# Altium schematic sheet MCU.SchDoc: Firefly Mini MCU
size Legal; DrawnBy: Jakub Czarny; SheetNumber: 2; SheetTotal: 7
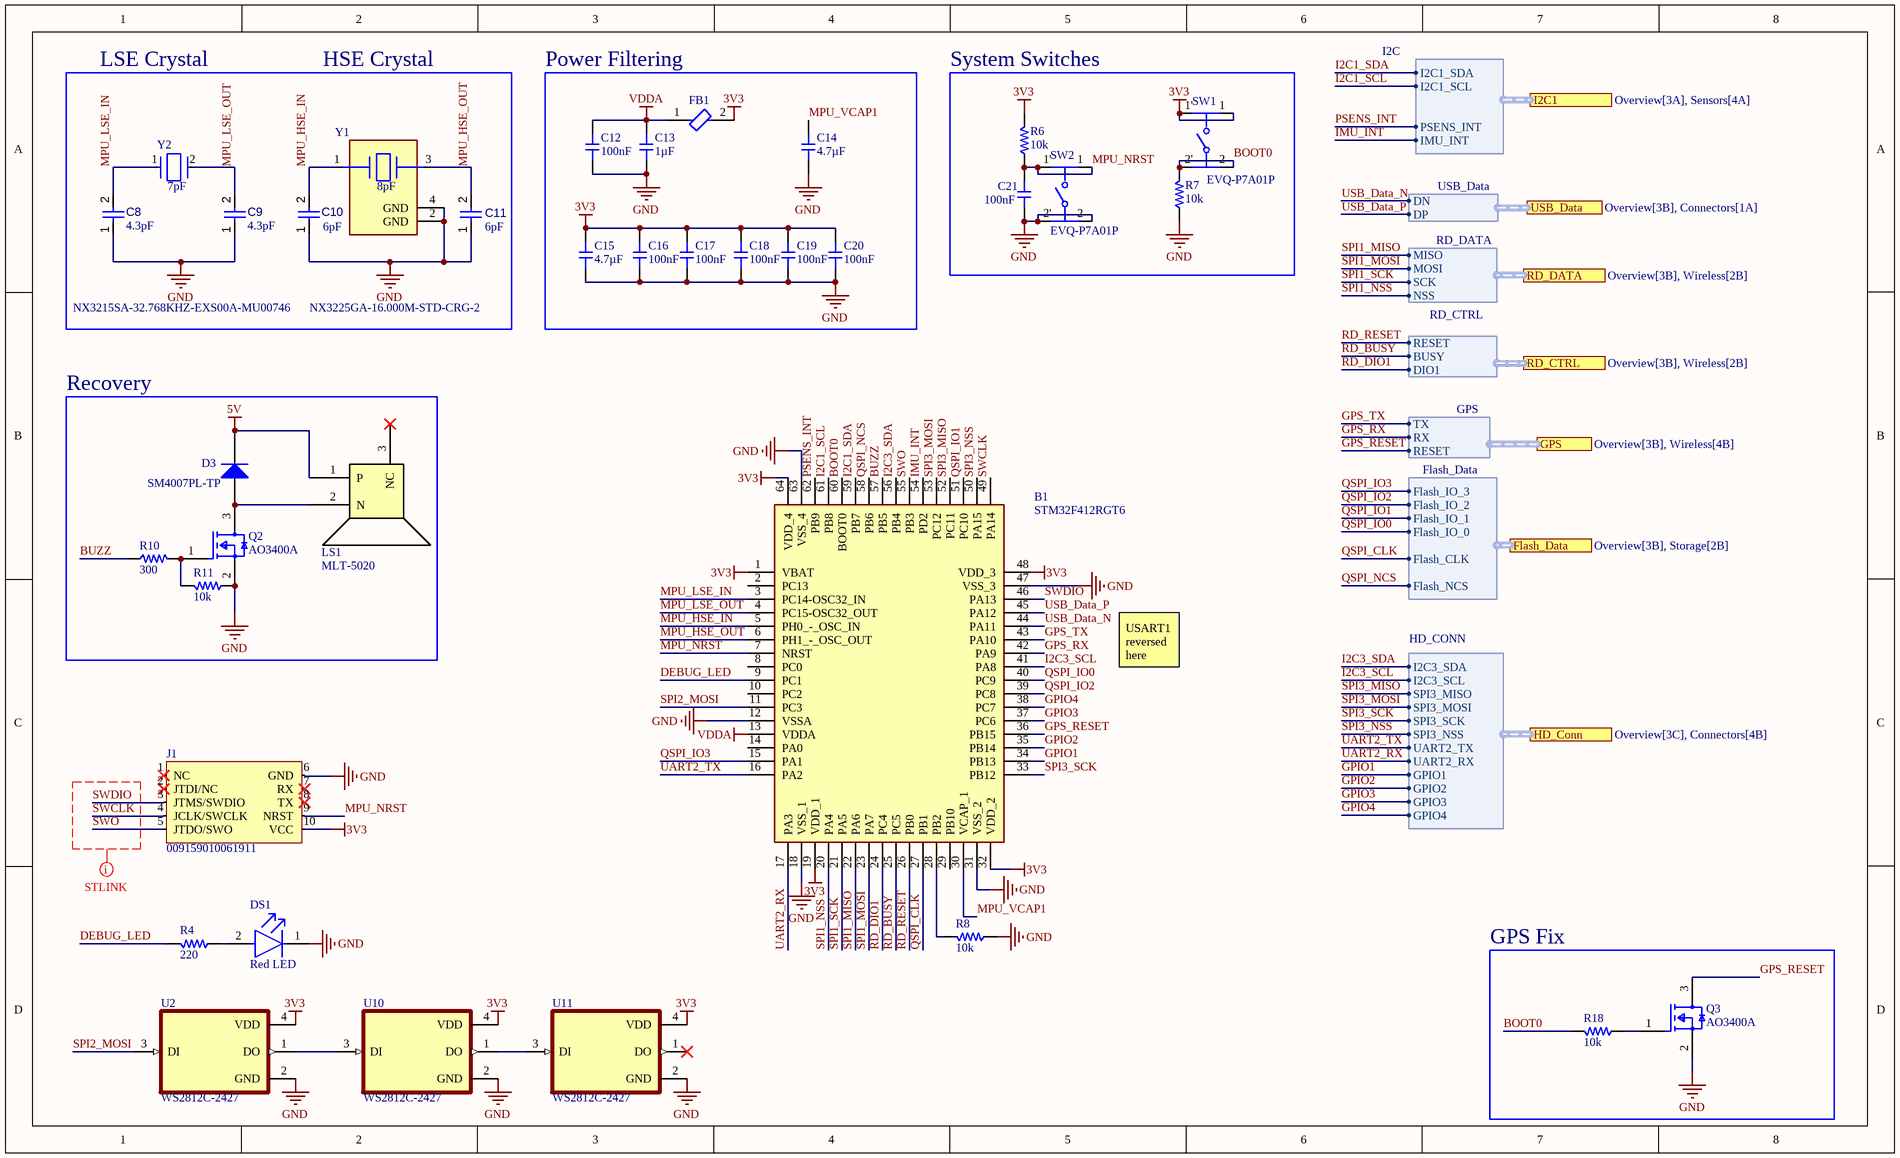
[diagram p0: MCU.SchDoc]

## Parts
B1  STM32F412RGT6  [QFP50P1200X1200X160-64N]
C8  value 4.3pF  [CAP-0402]  (hidden comment: C1005NP0439CGTS)
C9  value 4.3pF  [CAP-0402]  (hidden comment: C1005NP0439CGTS)
C10  value 6pF  [CAP-0402]  (hidden comment: 0402CG6R0C500NT)
C11  value 6pF  [CAP-0402]  (hidden comment: 0402CG6R0C500NT)
C12  value 100nF  [CAP-0402]  (hidden comment: CL05B104KO5NNNC)
C13  value 1µF  [CAP-0402]  (hidden comment: CL05A105KA5NQNC)
C14  value 4.7µF  [CAP-0402]  (hidden comment: CL05A475MP5NRNC)
C15  value 4.7µF  [CAP-0402]  (hidden comment: CL05A475MP5NRNC)
C16  value 100nF  [CAP-0402]  (hidden comment: CL05B104KO5NNNC)
C17  value 100nF  [CAP-0402]  (hidden comment: CL05B104KO5NNNC)
C18  value 100nF  [CAP-0402]  (hidden comment: CL05B104KO5NNNC)
C19  value 100nF  [CAP-0402]  (hidden comment: CL05B104KO5NNNC)
C20  value 100nF  [CAP-0402]  (hidden comment: CL05B104KO5NNNC)
C21  value 100nF  [CAP-0402]  (hidden comment: CL05B104KO5NNNC)
D3  SM4007PL-TP  [MCC-SOD-123FL_V]
DS1  Red LED  [FP-LTST-C190GKT-MFG]
FB1  BLM15AG601SN1D  [FP-BLM15-0_05-IPC_A]  (value not drawn)
J1  009159010061911  [009159010061911-Footprint-1]
LS1  MLT-5020  [MLT-5020]
Q2  AO3400A  [FP-SOT23-IPC_C]
Q3  AO3400A  [FP-SOT23-IPC_C]
R4  value 220  [RES-0402]  (hidden comment: 0402WGF2200TCE)
R6  value 10k  [RES-0402]  (hidden comment: 0402WGF1002TCE)
R7  value 10k  [RES-0402]  (hidden comment: 0402WGF1002TCE)
R8  value 10k  [RES-0402]  (hidden comment: 0402WGF1002TCE)
R10  value 300  [RES-0402]  (hidden comment: 0402WGF3000TCE)
R11  value 10k  [RES-0402]  (hidden comment: 0402WGF1002TCE)
R18  value 10k  [RES-0402]  (hidden comment: 0402WGF1002TCE)
SW1  EVQ-P7A01P  [FP-EVQ-P7A01P-MFG]
SW2  EVQ-P7A01P  [FP-EVQ-P7A01P-MFG]
U2  WS2812C-2427  [WS2812C-2427-Footprint-1]
U10  WS2812C-2427  [WS2812C-2427-Footprint-1]
U11  WS2812C-2427  [WS2812C-2427-Footprint-1]
Y1  NX3225GA-16.000M-STD-CRG-2  value 8pF  [FP-NX3225GA-MFG]
Y2  NX3215SA-32.768KHZ-EXS00A-MU00746  value 7pF  [FP-NX3215SA-MFG]

## Blocks framed on the sheet
Power Filtering: C12-C20 FB1
System Switches: C21 R6 R7 SW1 SW2
Recovery: D3 LS1 Q2 R10 R11
GPS Fix: Q3 R18

## Ports
Flash_Data (harness Flash_Data, see Overview[3B], Storage[2B]), GPS (harness GPS, see Overview[3B], Wireless[4B]), HD_Conn (harness HD_CONN, see Overview[3C], Connectors[4B]), I2C1 (harness I2C, see Overview[3A], Sensors[4A]), RD_CTRL (harness RD_CTRL, see Overview[3B], Wireless[2B]), RD_DATA (harness RD_DATA, see Overview[3B], Wireless[2B]), USB_Data (harness USB_Data, see Overview[3B], Connectors[1A])

## Harnesses
USB_Data: DP, DN
RD_DATA: MISO, MOSI, SCK, NSS
RD_CTRL: RESET, BUSY, DIO1
GPS: TX, RX, RESET
Flash_Data: Flash_NCS, Flash_CLK, Flash_IO_0, Flash_IO_1, Flash_IO_2, Flash_IO_3
I2C: I2C1_SDA, I2C1_SCL, PSENS_INT, IMU_INT
HD_CONN: I2C3_SDA, I2C3_SCL, SPI3_MISO, SPI3_MOSI, SPI3_SCK, SPI3_NSS, UART2_TX, UART2_RX, GPIO1, GPIO2, GPIO3, GPIO4

## Nets
3V3: B1.1(VBAT) B1.19(VDD_1) B1.32(VDD_2) B1.48(VDD_3) B1.64(VDD_4) C15.2 C16.2 C17.2 C18.2 C19.2 C20.2 FB1.2 J1.10(VCC) R6.2 SW1.1 SW1.1' U2.4(VDD) U10.4(VDD) U11.4(VDD)
5V: D3.2(K) LS1.1(P)
GND: B1.12(VSSA) B1.18(VSS_1) B1.31(VSS_2) B1.47(VSS_3) B1.63(VSS_4) C8.1 C9.1 C10.1 C11.1 C12.1 C13.1 C14.1 C15.1 C16.1 C17.1 C18.1 C19.1 C20.1 C21.1 DS1.1(C) J1.6(GND) Q2.2(S) Q3.2(S) R7.1 R8.1 R11.1 SW2.2 SW2.2' U2.2(GND) U10.2(GND) U11.2(GND) Y1.2(GND) Y1.4(GND)
VDDA: B1.13(VDDA) C12.2 C13.2 FB1.1
BOOT0: B1.60(BOOT0) R7.2 R18.2 SW1.2 SW1.2'
BUZZ: B1.57(PB5) R10.1
DEBUG_LED: B1.9(PC1) R4.2
GPIO1: B1.34(PB13) ; port HD_Conn.GPIO1
GPIO2: B1.35(PB14) ; port HD_Conn.GPIO2
GPIO3: B1.37(PC6) ; port HD_Conn.GPIO3
GPIO4: B1.38(PC7) ; port HD_Conn.GPIO4
GPS_RESET: B1.36(PB15) Q3.3(D) ; port GPS.RESET
GPS_RX: B1.42(PA9) ; port GPS.RX
GPS_TX: B1.43(PA10) ; port GPS.TX
I2C1_SCL: B1.61(PB8) ; port I2C1.I2C1_SCL
I2C1_SDA: B1.59(PB7) ; port I2C1.I2C1_SDA
I2C3_SCL: B1.41(PA8) ; port HD_Conn.I2C3_SCL
I2C3_SDA: B1.56(PB4) ; port HD_Conn.I2C3_SDA
IMU_INT: B1.54(PD2) ; port I2C1.IMU_INT
MPU_HSE_IN: B1.5(PH0_-_OSC_IN) C10.2 Y1.1
MPU_HSE_OUT: B1.6(PH1_-_OSC_OUT) C11.2 Y1.3
MPU_LSE_IN: B1.3(PC14-OSC32_IN) C8.2 Y2.1
MPU_LSE_OUT: B1.4(PC15-OSC32_OUT) C9.2 Y2.2
MPU_NRST: B1.7(NRST) C21.2 J1.9(NRST) R6.1 SW2.1 SW2.1'
MPU_VCAP1: B1.30(VCAP_1) C14.2
PSENS_INT: B1.62(PB9) ; port I2C1.PSENS_INT
QSPI_CLK: B1.27(PB1) ; port Flash_Data.Flash_CLK
QSPI_IO0: B1.40(PC9) ; port Flash_Data.Flash_IO_0
QSPI_IO1: B1.51(PC10) ; port Flash_Data.Flash_IO_1
QSPI_IO2: B1.39(PC8) ; port Flash_Data.Flash_IO_2
QSPI_IO3: B1.15(PA1) ; port Flash_Data.Flash_IO_3
QSPI_NCS: B1.58(PB6) ; port Flash_Data.Flash_NCS
RD_BUSY: B1.25(PC5) ; port RD_CTRL.BUSY
RD_DIO1: B1.24(PC4) ; port RD_CTRL.DIO1
RD_RESET: B1.26(PB0) ; port RD_CTRL.RESET
SPI1_MISO: B1.22(PA6) ; port RD_DATA.MISO
SPI1_MOSI: B1.23(PA7) ; port RD_DATA.MOSI
SPI1_NSS: B1.20(PA4) ; port RD_DATA.NSS
SPI1_SCK: B1.21(PA5) ; port RD_DATA.SCK
SPI2_MOSI: B1.11(PC3) U2.3(DI)
SPI3_MISO: B1.52(PC11) ; port HD_Conn.SPI3_MISO
SPI3_MOSI: B1.53(PC12) ; port HD_Conn.SPI3_MOSI
SPI3_NSS: B1.50(PA15) ; port HD_Conn.SPI3_NSS
SPI3_SCK: B1.33(PB12) ; port HD_Conn.SPI3_SCK
SWCLK: B1.49(PA14) J1.4(JCLK/SWCLK)
SWDIO: B1.46(PA13) J1.3(JTMS/SWDIO)
SWO: B1.55(PB3) J1.5(JTDO/SWO)
UART2_RX: B1.17(PA3) ; port HD_Conn.UART2_RX
UART2_TX: B1.16(PA2) ; port HD_Conn.UART2_TX
USB_Data_N: B1.44(PA11) ; port USB_Data.DN
USB_Data_P: B1.45(PA12) ; port USB_Data.DP
NetB1_28: B1.28(PB2) R8.2
NetD3_1: D3.1(A) LS1.2(N) Q2.3(D)
NetDS1_2: DS1.2(A) R4.1
NetQ2_1: Q2.1(G) R10.2 R11.2
NetQ3_1: Q3.1(G) R18.1
NetU2_1: U2.1(DO) U10.3(DI)
NetU10_1: U10.1(DO) U11.3(DI)

Not connected (* = marked no-connect by the designer): B1 2(PC13) 8(PC0) 10(PC2) 14(PA0) 29(PB10); J1 1(NC)* 2(JTDI/NC)* 7(RX)* 8(TX)*; LS1 3(NC)*; U11 1(DO)*

## Layout directives
rule Matched Net Lengths [Tolerance = 0.1mm]; net class STLINK: SWCLK, SWDIO, SWO

## Notes on the sheet
- LSE Crystal
- HSE Crystal
- USART1 reversed here

## Library data of the parts
B1 = CMP-020-00025-2: ARM Microcontrollers - MCU 16/32-BITS MICROS; Manufacturer: STMicroelectronics; Geometry.Height: 1.6mm; Arrow Price/Stock: https://www.arrow.com/en/products/stm32f412rgt6/stmicroelectronics?region=nac; Design Item ID: STM32F412RGT6; Manufacturer_Part_Number: STM32F412RGT6; Mouser Price/Stock: https://www.mouser.co.uk/ProductDetail/STMicroelectronics/STM32F412RGT6?qs=qzCNEk%252BRr%252Bb0WoPVhlRQfQ%3D%3D; Mouser Part Number: 511-STM32F412RGT6; Source: STM32F412RGT6.SchLib; Arrow Part Number: STM32F412RGT6; Datasheet Link: http://www.st.com/content/ccc/resource/technical/document/datasheet/15/90/07/b3/8c/10/4e/95/DM00213872.pdf/files/DM00213872.pdf/jcr:content/translations/en.DM00213872.pdf; JLCPCB Part Number: C94351
C8 C9 = CMP-001-02165-2: 50V 4.3pF NP0 0402  Multilayer Ceramic Capacitors MLCC - SMD/SMT ROHS; JLCPCB Part Number: C147367
C10 C11 = CMP-001-02164-2: 50V 6pF C0G 0402  Multilayer Ceramic Capacitors MLCC - SMD/SMT ROHS; JLCPCB Part Number: C1575
C12 C16-C21 = CMP-001-00142-1: Capacitor, Ceramic (MLCC), 100nF, ±10%, 16V, X7R, ±10%, SMD 0402; Manufacturer: Samsung Electro-Mechanics; Design Item ID: CL05B104KO5NNNC; Source: jlcpcb_capacitors_basic.schlib; ComponentLink2URL: https://jlcpcb.com/partdetail/C1525; Voltage Rating: 16V; Tolerance: 10%; Temperature Coefficient: X7R; ComponentLink2Description: JLCPCB Part URL; ComponentLink1URL: https://datasheet.lcsc.com/lcsc/1810191219_Samsung-Electro-Mechanics-CL05B104KO5NNNC_C1525.pdf; JLCPCB Basic Part: Yes; JLCPCB Part Number: C1525; ComponentLink3URL: https://lcsc.com/product-detail/Multilayer-Ceramic-Capacitors-MLCC---SMD-SMT_Samsung-Electro-Mechanics-Samsung-Electro-Mechanics-CL05B104KO5NNNC_C1525.html; Manufacturer Part Number: CL05B104KO5NNNC; ComponentLink1Description: Datasheet; Case/Package: 0402; RoHS: Yes; Category: Capacitors - MLCC; ComponentLink3Description: LCSC Part URL
C13 = CMP-001-00135-1: Capacitor, Ceramic (MLCC), 1uF, ±10%, 25V, X5R, ±10%, SMD 0402; Manufacturer: Samsung Electro-Mechanics; Voltage Rating: 25V; RoHS: Yes; Temperature Coefficient: X5R; Tolerance: 10%; Source: jlcpcb_capacitors_basic.schlib; ComponentLink1URL: https://datasheet.lcsc.com/lcsc/1811091611_Samsung-Electro-Mechanics-CL05A105KA5NQNC_C52923.pdf; JLCPCB Basic Part: Yes; ComponentLink1Description: Datasheet; ComponentLink2URL: https://jlcpcb.com/partdetail/C52923; Case/Package: 0402; ComponentLink3Description: LCSC Part URL; Manufacturer Part Number: CL05A105KA5NQNC; ComponentLink3URL: https://lcsc.com/product-detail/Multilayer-Ceramic-Capacitors-MLCC---SMD-SMT_Samsung-Electro-Mechanics-Samsung-Electro-Mechanics-CL05A105KA5NQNC_C52923.html; Design Item ID: CL05A105KA5NQNC; JLCPCB Part Number: C52923; ComponentLink2Description: JLCPCB Part URL; Category: Capacitors - MLCC
C14 C15 = CMP-001-00139-1: Capacitor, Ceramic (MLCC), 4.7uF, ±20%, 10V, X5R, ±20%, SMD 0402; Manufacturer: Samsung Electro-Mechanics; RoHS: Yes; Tolerance: 20%; Manufacturer Part Number: CL05A475MP5NRNC; ComponentLink3Description: LCSC Part URL; Source: jlcpcb_capacitors_basic.schlib; JLCPCB Part Number: C23733; ComponentLink2Description: JLCPCB Part URL; Temperature Coefficient: X5R; Voltage Rating: 10V; JLCPCB Basic Part: Yes; Case/Package: 0402; Category: Capacitors - MLCC; ComponentLink1URL: https://datasheet.lcsc.com/lcsc/1810191211_Samsung-Electro-Mechanics-CL05A475MP5NRNC_C23733.pdf; ComponentLink2URL: https://jlcpcb.com/partdetail/C23733; ComponentLink1Description: Datasheet; ComponentLink3URL: https://lcsc.com/product-detail/Multilayer-Ceramic-Capacitors-MLCC---SMD-SMT_Samsung-Electro-Mechanics-Samsung-Electro-Mechanics-CL05A475MP5NRNC_C23733.html; Design Item ID: CL05A475MP5NRNC
D3 = CMP-004-00034-1: DIODE GEN PURP 1KV 1A SOD123FL; LCSC Part #: C64898; JLCPCB Part Number: C64898
DS1 = CMP-00026-00001-1: SZYY0603R; JLCPCB Part Number: C2286
FB1 = CMP-006-00022-1: 520mΩ ±25% 600Ω@100MHz 0402  Ferrite Beads ROHS; Current Rating: 300mA; DC Resistance-Max: 520mR; RoHS Compliant: Yes; Max Operating Temperature: 125°C; Construction: Chip Bead; JLCPCB Part Number: C76884; Min Operating Temperature: -55°C; Mounting Technology: Surface Mount; Case Code: 0402
J1 = CMP-002-00088-4: AVX edge to edge connector 10pin
LS1 = CMP-00027-00002-1: Externally Driven Magnetic 4000Hz SMD,5x5mm  Buzzers ROHS; JLCPCB Part Number: C94598
Q2 Q3 = CMP-013-00038-1: N沟道 VDS=30V VGS=±12V ID=5.7A P=1.4W; JLCPCB Part Number: C20917
  Q2: LCSC Part #: C20917
R4 = CMP-009-00210-1: Resistor, 220Ω, ±1%, 62.5mW, 50V, ±100ppm/℃, -55℃~+155℃, SMD 0402; Manufacturer: Uniroyal; Category: Resistors; Case/Package: 0402; Temperature Rating: -55℃~+155℃; Temperature Coefficient: ±100ppm/℃; ComponentLink2URL: https://jlcpcb.com/partdetail/C25091; Tolerance: 1%; JLCPCB Part Number: C25091; Source: jlcpcb_resistors_basic.schlib; Power Rating: 62.5mW; Design Item ID: 0402WGF2200TCE; ComponentLink1URL: https://datasheet.lcsc.com/lcsc/2205311900_UNI-ROYAL-Uniroyal-Elec-0402WGF2200TCE_C25091.pdf; JLCPCB Basic Part: Yes; Manufacturer Part Number: 0402WGF2200TCE; Voltage Rating: 50V; ComponentLink2Description: JLCPCB Part URL; ComponentLink1Description: Datasheet
R6-R8 R11 R18 = CMP-009-00191-1: Resistor, 10kΩ, ±1%, 62.5mW, 50V, ±100ppm/℃, -55℃~+155℃, SMD 0402; Manufacturer: Uniroyal; Temperature Rating: -55℃~+155℃; ComponentLink1URL: https://datasheet.lcsc.com/lcsc/2206010100_UNI-ROYAL-Uniroyal-Elec-0402WGF1002TCE_C25744.pdf; Source: jlcpcb_resistors_basic.schlib; Tolerance: 1%; Design Item ID: 0402WGF1002TCE; ComponentLink1Description: Datasheet; ComponentLink2URL: https://jlcpcb.com/partdetail/C25744; Category: Resistors; JLCPCB Part Number: C25744; ComponentLink2Description: JLCPCB Part URL; Temperature Coefficient: ±100ppm/℃; JLCPCB Basic Part: Yes; Power Rating: 62.5mW; Case/Package: 0402; Voltage Rating: 50V; Manufacturer Part Number: 0402WGF1002TCE
R10 = CMP-009-00218-1: Resistor, 300Ω, ±1%, 62.5mW, 50V, ±100ppm/℃, -55℃~+155℃, SMD 0402; Manufacturer: Uniroyal; JLCPCB Part Number: C25102; ComponentLink2URL: https://jlcpcb.com/partdetail/C25102; Manufacturer Part Number: 0402WGF3000TCE; ComponentLink2Description: JLCPCB Part URL; Voltage Rating: 50V; ComponentLink1Description: Datasheet; Source: jlcpcb_resistors_basic.schlib; Tolerance: 1%; Category: Resistors; Power Rating: 62.5mW; Design Item ID: 0402WGF3000TCE; Temperature Coefficient: ±100ppm/℃; JLCPCB Basic Part: Yes; Case/Package: 0402; ComponentLink1URL: https://datasheet.lcsc.com/lcsc/2205311900_UNI-ROYAL-Uniroyal-Elec-0402WGF3000TCE_C25102.pdf; Temperature Rating: -55℃~+155℃
SW1 SW2 = CMP-011-00021-3: Switch Tactile N.O. SPST Rectangular Button Gull Wing 0.05A 12VDC 2.2N SMD Embossed T/R; JLCPCB Part Number: C79167
U2 U10 U11 = CMP-007-00037-1: SMD,2.4x2.7mm  Light Emitting Diodes (LED) ROHS; JLCPCB Part Number: C4154872
Y1 = CMP-003-00030-1: Crystal 16MHz ±20ppm (Tol) ±30ppm (Stability) 8pF FUND 80Ohm Automotive 4-Pin SMD; JLCPCB Part Number: C156247
Y2 = CMP-003-00031-1: Crystal 32.7680KHZ 7PF SMD; JLCPCB Part Number: C5136773